# Altium project BW1097_R2M2E3.PrjPcb (part 9 of 10)
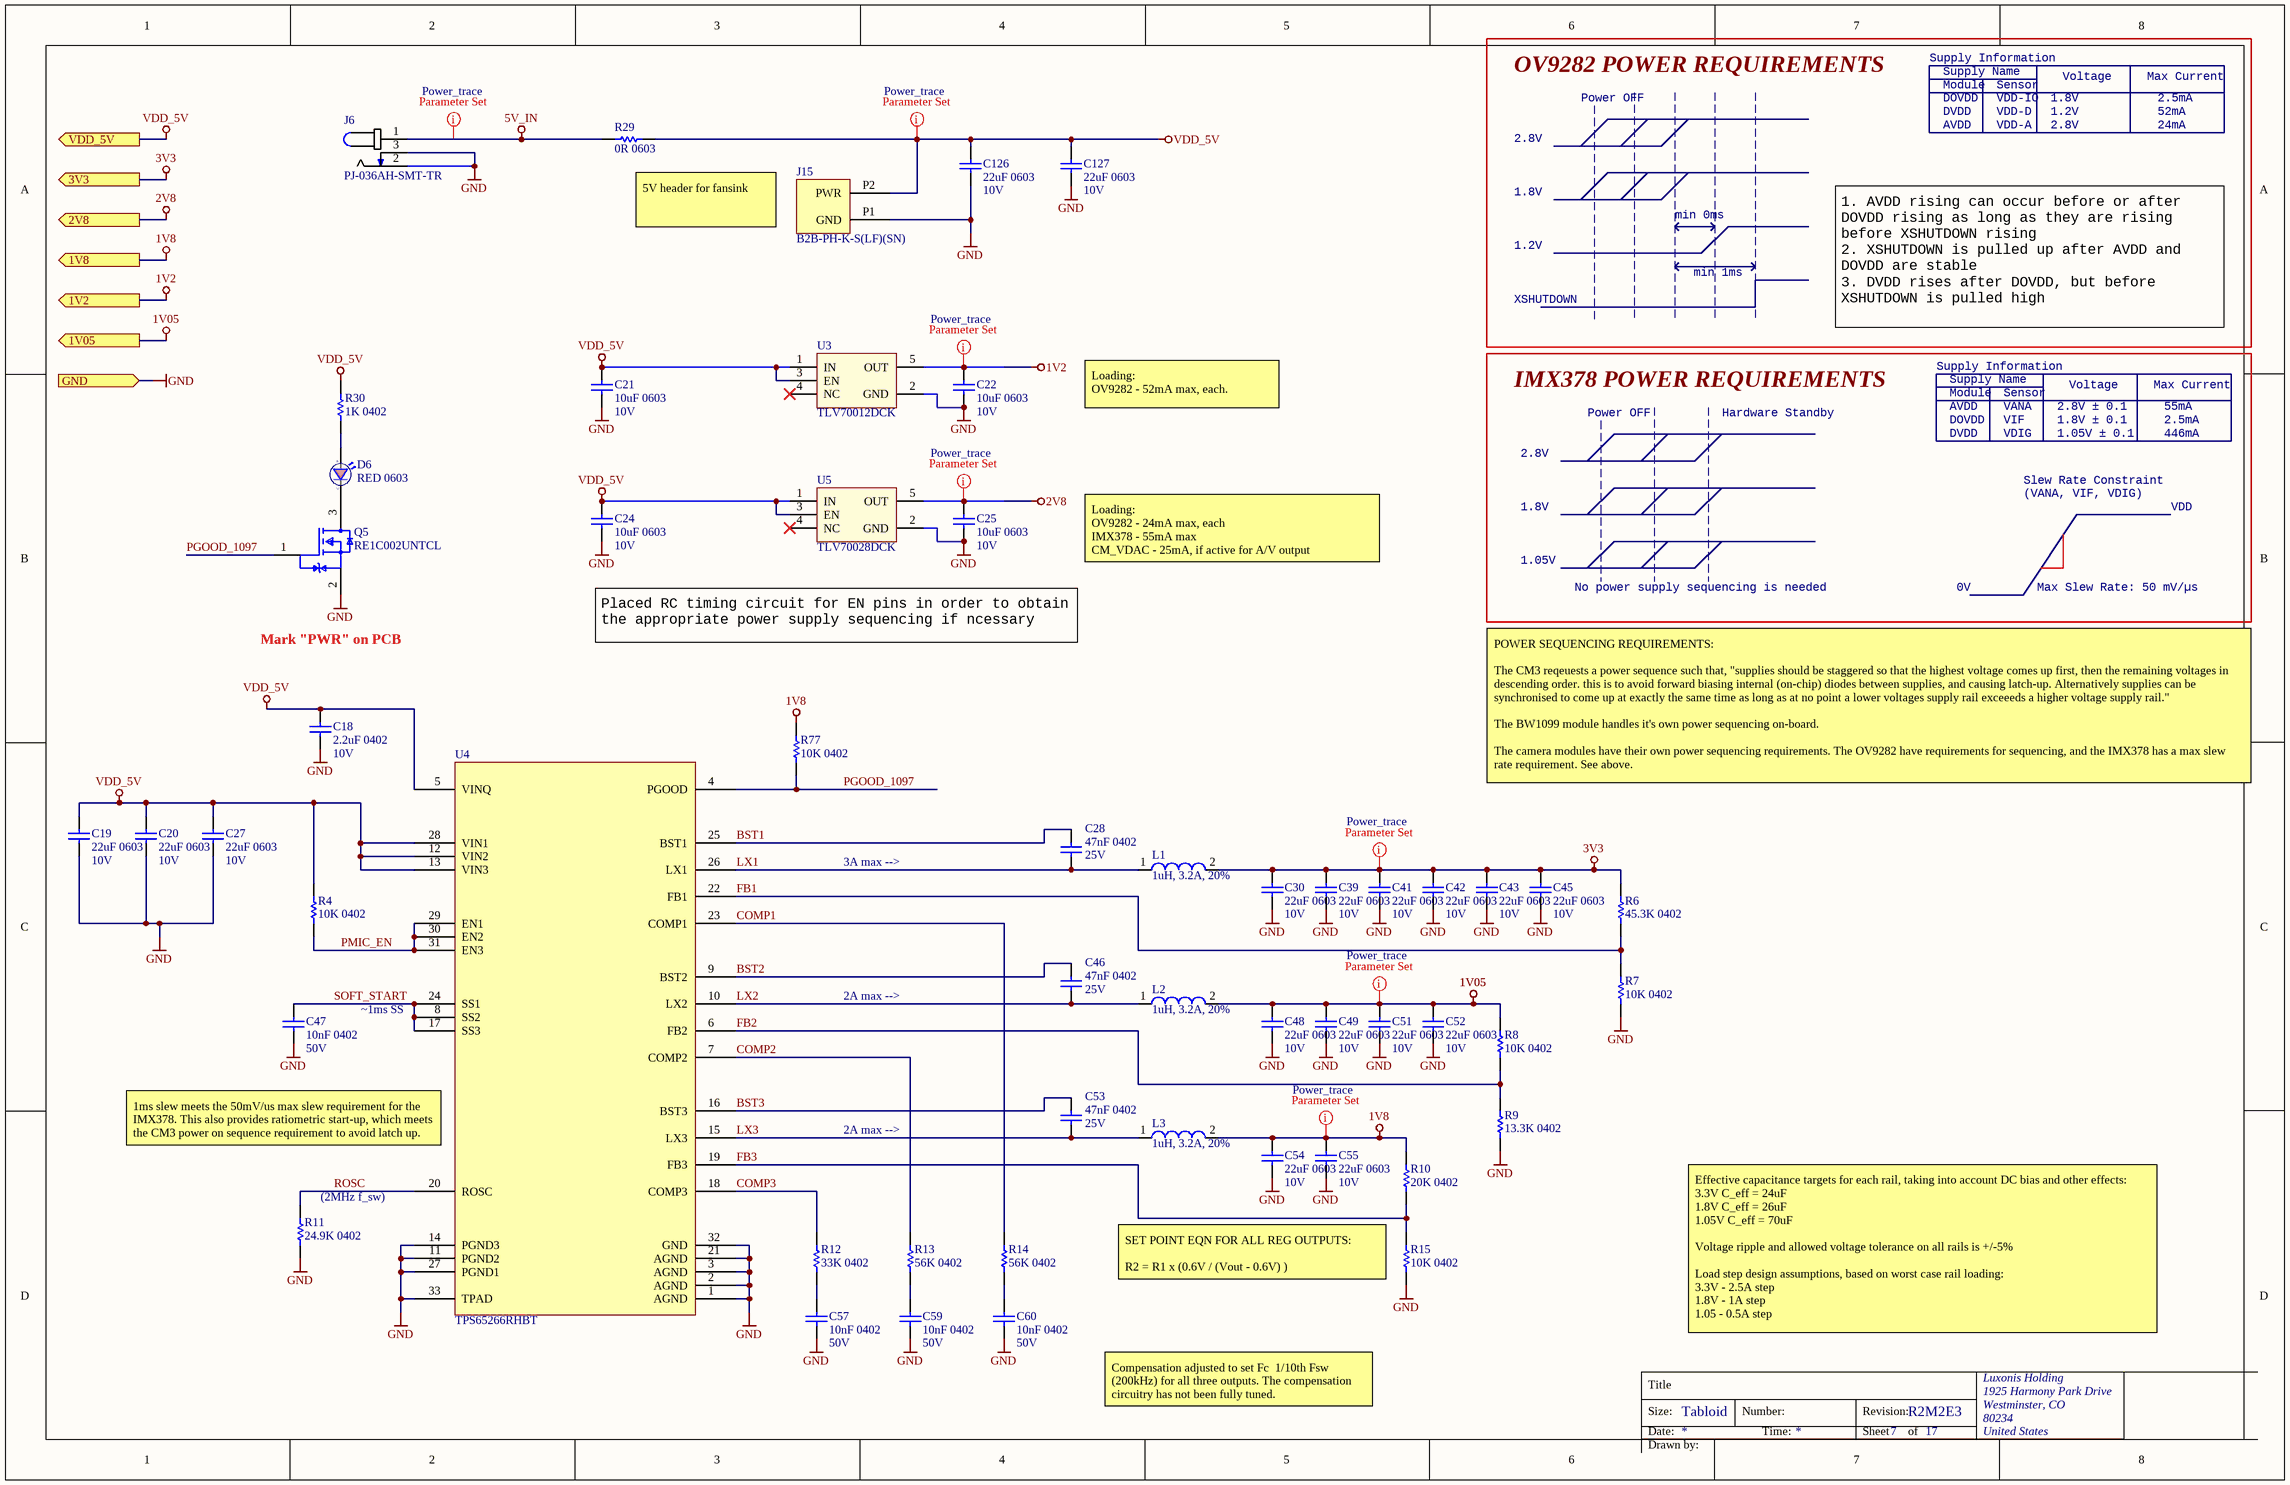
[diagram p116: BW1097_Power_Supply.SchDoc]

## Sheet BW1097_Power_Supply.SchDoc: =project_title (continued)

### Library data of the parts (continued)
U3 = TLV70012DCK: IC REG LINEAR 1.2V 200MA SC70-5; Manufacturer 1: Texas Instruments; Manufacturer Part Number 1: TLV70012DCKR; Max Power Dissipation: 320mW; Number of Outputs: 1; Dropout Voltage: 175mV; Max Input Voltage: 5.5V; Min Input Voltage: 2V; Min Current Limit: 220mA; Polarity: Positive; Accuracy: 2%; Quiescent Current: 30uA; Output Type: Fixed; Supplier 1: Digi-Key; Stock 1: 8389; Pricing 1: 1=0.48000, 10=0.40900, 100=0.30570, 500=0.24020, 1000=0.18561 (USD); RoHS: Yes; Case/Package: SC; Number of Pins: 5; Contact Plating: Gold; Min Operating Temperature: -40°C; Max Operating Temperature: 125°C; Output Voltage: 1.2V; Packaging: Tape and Reel; Output Current: 200mA; Package Quantity: 1; Max Output Current: 200mA; Number of Regulators: 1; Power Dissipation: 320mW; Min Output Voltage: 1.2V; Output Voltage Accuracy: 2%; Max Output Voltage: 1.2V; Nominal Output Voltage: 1.2V; Radiation Hardening: No; Lead Free: Lead Free; REACH SVHC: No SVHC; ComponentLink1URL: https://datasheet.ciiva.com/26909/tlv70012dckr-26909420.pdf?src-supplier=IIIC; ComponentLink1Description: https://datasheet.ciiva.com/26909/tlv70012dckr-26909420.pdf?src-supplier=IIIC; ComponentLink2URL: https://datasheet.ciiva.com/46448/1836520-46448747.pdf?src-supplier=Element14; ComponentLink2Description: https://datasheet.ciiva.com/46448/1836520-46448747.pdf?src-supplier=Element14; Supplier Part Number 1: 296-27438-1-ND; Supplier 2: TI store; Manufacturer 2: Texas Instruments; Manufacturer Part Number 2: TLV70012DCKT; Stock 2: 250; Pricing 2: 1=0.43000, 10=0.38000, 25=0.35000, 100=0.30000, 250=0.27000, 500=0.21000, 750=0.16000, 1000=0.14000 (USD); ComponentLink3URL: http://components.arrow.com/part/dataview/48874348S9524109N7713?src-supplier=Arrow; ComponentLink3Description: http://components.arrow.com/part/dataview/48874348S9524109N7713?src-supplier=Arrow; ComponentLink4URL: http://components.arrow.com/part/dataview/0323_02210905?src-supplier=Arrow+Europe; ComponentLink4Description: http://components.arrow.com/part/dataview/0323_02210905?src-supplier=Arrow+Europe; ComponentLink5URL: http://www.ti.com/general/docs/lit/getliterature.tsp?genericPartNumber=TLV700&&fileType=pdf&src-supplier=Avnet; ComponentLink5Description: http://www.ti.com/general/docs/lit/getliterature.tsp?genericPartNumber=TLV700&&fileType=pdf&src-supplier=Avnet; ComponentLink6URL: http://focus.ti.com/lit/ds/symlink/tlv70033.pdf?src-supplier=Avnet; ComponentLink6Description: http://focus.ti.com/lit/ds/symlink/tlv70033.pdf?src-supplier=Avnet; ComponentLink7URL: http://www.ti.com/lit/ds/slvsa00e/slvsa00e.pdf?src-supplier=Digi-Key; ComponentLink7Description: http://www.ti.com/lit/ds/slvsa00e/slvsa00e.pdf?src-supplier=Digi-Key; ComponentLink8URL: http://www.ti.com/litv/slvsa00d?src-supplier=Mouser; ComponentLink8Description: http://www.ti.com/litv/slvsa00d?src-supplier=Mouser; Supplier Part Number 2: TLV70012DCKT
U4 = TPS65266RHBT: IC REG BCK ADJ 3A/2A TRPL 32VQFN Buck Switching Regulator IC Positive Adjustable 0.6V 3 Output 3A, 2A 32-VFQFN Exposed Pad; Manufacturer 1: Texas Instruments; Manufacturer: TI; Switching Frequency: 2.4MHz; Number of Outputs: 3; Min Input Voltage: 2.7V; Max Input Voltage: 6.5V; Min Output Voltage: 600mV; Synchronous Rectifier: Yes; Quiescent Current: 340uA; Manufacturer Part Number 1: TPS65266RHBT; Manufacturer PN: TPS65266; Package: 32-VQFN; Supplier 1: Digi-Key; Stock 1: 4557; Pricing 1: 1=4.01000, 10=3.59900, 100=2.94850 (USD); RoHS: Yes; Mount: Surface Mount; Case/Package: VQFN; Number of Pins: 32; Weight: 0.002547oz; Min Operating Temperature: -40°C; Max Operating Temperature: 85°C; Packaging: Tape and Reel; Output Current: 2A; Package Quantity: 250; Max Output Voltage: 6.5V; Operating Supply Voltage: 6.5V; Output Type: Adjustable; Output Configuration: Positive; Current - Output 1: 3A; Current - Output 2: 2A; Lead Free: Lead Free; REACH SVHC: No SVHC; ComponentLink1URL: http://www.ti.com/general/docs/lit/getliterature.tsp?genericPartNumber=TPS65266&&fileType=pdf&src-supplier=Element14; ComponentLink1Description: http://www.ti.com/general/docs/lit/getliterature.tsp?genericPartNumber=TPS65266&&fileType=pdf&src-supplier=Element14; ComponentLink2URL: http://www.ti.com/general/docs/lit/getliterature.tsp?genericPartNumber=TPS65266&amp;&amp;fileType=pdf&src-supplier=Farnell; ComponentLink2Description: http://www.ti.com/general/docs/lit/getliterature.tsp?genericPartNumber=TPS65266&amp;&amp;fileType=pdf&src-supplier=Farnell; ComponentLink3URL: http://www.ti.com/general/docs/lit/getliterature.tsp?genericPartNumber=TPS65266&&fileType=pdf&src-supplier=Farnell; ComponentLink3Description: http://www.ti.com/general/docs/lit/getliterature.tsp?genericPartNumber=TPS65266&&fileType=pdf&src-supplier=Farnell; ComponentLink4URL: http://www.ti.com/lit/ds/symlink/tps65266.pdf?src-supplier=Digi-Key; ComponentLink4Description: http://www.ti.com/lit/ds/symlink/tps65266.pdf?src-supplier=Digi-Key; ComponentLink5URL: http://www.ti.com/lit/gpn/tps65266?src-supplier=Mouser; ComponentLink5Description: http://www.ti.com/lit/gpn/tps65266?src-supplier=Mouser; ComponentLink6URL: http://www.ti.com/general/docs/lit/getliterature.tsp?genericPartNumber=TPS65266&&fileType=pdf&src-supplier=Avnet; ComponentLink6Description: http://www.ti.com/general/docs/lit/getliterature.tsp?genericPartNumber=TPS65266&&fileType=pdf&src-supplier=Avnet; Supplier Part Number 1: 296-38685-1-ND; Supplier 2: TI store; Supplier 3: Mouser; Supplier Part Number 2: TPS65266RHBT; Supplier Part Number 3: 595-TPS65266RHBT
U5 = TLV70028DCK: IC REG LINEAR 2.8V 200MA SC70-5 Linear Voltage Regulator IC  1 Output  200mA SC-70-5; Manufacturer 1: Texas Instruments; Manufacturer Part Number 1: TLV70028DCKT; Dropout Voltage: 175mV; Number of Outputs: 1; Max Power Dissipation: 320mW; Max Input Voltage: 5.5V; Min Input Voltage: 2V; Min Current Limit: 220mA; Polarity: Positive; Quiescent Current: 30uA; Accuracy: 2%; Output Type: Fixed; Nominal Supply Current: 31uA; Supplier 1: Digi-Key; Stock 1: 832; Pricing 1: 1=0.55000, 10=0.46700, 100=0.34900 (USD); RoHS: Yes; Case/Package: SC; Number of Pins: 5; Contact Plating: Gold; Min Operating Temperature: -40°C; Max Operating Temperature: 125°C; Package Quantity: 1; Packaging: Tape and Reel; Output Current: 200mA; Output Voltage: 2.8V; Max Output Current: 200mA; Number of Regulators: 1; Power Dissipation: 320mW; Min Output Voltage: 2.8V; Output Voltage Accuracy: 2%; Max Output Voltage: 2.8V; Max Supply Voltage: 5.5V; Min Supply Voltage: 2V; Nominal Output Voltage: 2.8V; Power Rating: 320mW; Termination: SMD/SMT; Length: 2.15mm; Height: 1mm; Width: 1.4mm; Radiation Hardening: No; Lead Free: Lead Free; REACH SVHC: No SVHC; ComponentLink1URL: https://datasheet.ciiva.com/14149/tlv700-eng-ds-14149840.pdf?src-supplier=Distrelec; ComponentLink1Description: https://datasheet.ciiva.com/14149/tlv700-eng-ds-14149840.pdf?src-supplier=Distrelec; ComponentLink2URL: https://datasheet.ciiva.com/22700/1882059-22700172.pdf?src-supplier=Element14; ComponentLink2Description: https://datasheet.ciiva.com/22700/1882059-22700172.pdf?src-supplier=Element14; Supplier 2: Digi-Key; Manufacturer 2: Texas Instruments; Manufacturer Part Number 2: TLV70028DCKR; Stock 2: 30013; Pricing 2: 1=0.48000, 10=0.40900, 100=0.30570, 500=0.24020, 1000=0.18561 (USD); ComponentLink3URL: http://components.arrow.com/part/dataview/0323_00585634?src-supplier=Arrow+Europe; ComponentLink3Description: http://components.arrow.com/part/dataview/0323_00585634?src-supplier=Arrow+Europe; ComponentLink4URL: http://focus.ti.com/lit/ds/symlink/tlv70033.pdf?src-supplier=Avnet+Europe; ComponentLink4Description: http://focus.ti.com/lit/ds/symlink/tlv70033.pdf?src-supplier=Avnet+Europe; ComponentLink5URL: http://www.ti.com/lit/ds/slvsa00d/slvsa00d.pdf?src-supplier=Digi-Key; ComponentLink5Description: http://www.ti.com/lit/ds/slvsa00d/slvsa00d.pdf?src-supplier=Digi-Key; ComponentLink6URL: http://www.ti.com/lit/pdf/slyy050?src-supplier=Digi-Key; ComponentLink6Description: http://www.ti.com/lit/pdf/slyy050?src-supplier=Digi-Key; ComponentLink7URL: http://www.ti.com/general/docs/lit/getliterature.tsp?genericPartNumber=TLV700&&fileType=pdf&src-supplier=Avnet+Asia; ComponentLink7Description: http://www.ti.com/general/docs/lit/getliterature.tsp?genericPartNumber=TLV700&&fileType=pdf&src-supplier=Avnet+Asia; ComponentLink8URL: http://www.ti.com/general/docs/lit/getliterature.tsp?genericPartNumber=TLV700&&fileType=pdf&src-supplier=Avnet; ComponentLink8Description: http://www.ti.com/general/docs/lit/getliterature.tsp?genericPartNumber=TLV700&&fileType=pdf&src-supplier=Avnet; ComponentLink9URL: http://components.arrow.com/part/dataview/48329233S8322732N7713?src-supplier=Arrow; ComponentLink9Description: http://components.arrow.com/part/dataview/48329233S8322732N7713?src-supplier=Arrow; ComponentLink10URL: http://www.ti.com/litv/slvsa00d?src-supplier=Mouser; ComponentLink10Description: http://www.ti.com/litv/slvsa00d?src-supplier=Mouser; ComponentLink11URL: http://www.ti.com/lit/ds/slvsa00e/slvsa00e.pdf?src-supplier=Digi-Key; ComponentLink11Description: http://www.ti.com/lit/ds/slvsa00e/slvsa00e.pdf?src-supplier=Digi-Key; Supplier Part Number 1: 296-25271-1-ND; Supplier Part Number 2: 296-39279-1-ND

## Sheet BW1097_HDMI.SchDoc: =project_title
size Tabloid; CompanyName: Luxonis Holding; DrawnBy: Brian Weinstein; Organization: Luxonis Holding; Address1: 1925 Harmony Park Drive; Address2: Westminster, CO; Address3: 80234; Address4: United States; DocumentNumber: D0000196; Revision: R2M2E3; SheetNumber: 12; SheetTotal: 17
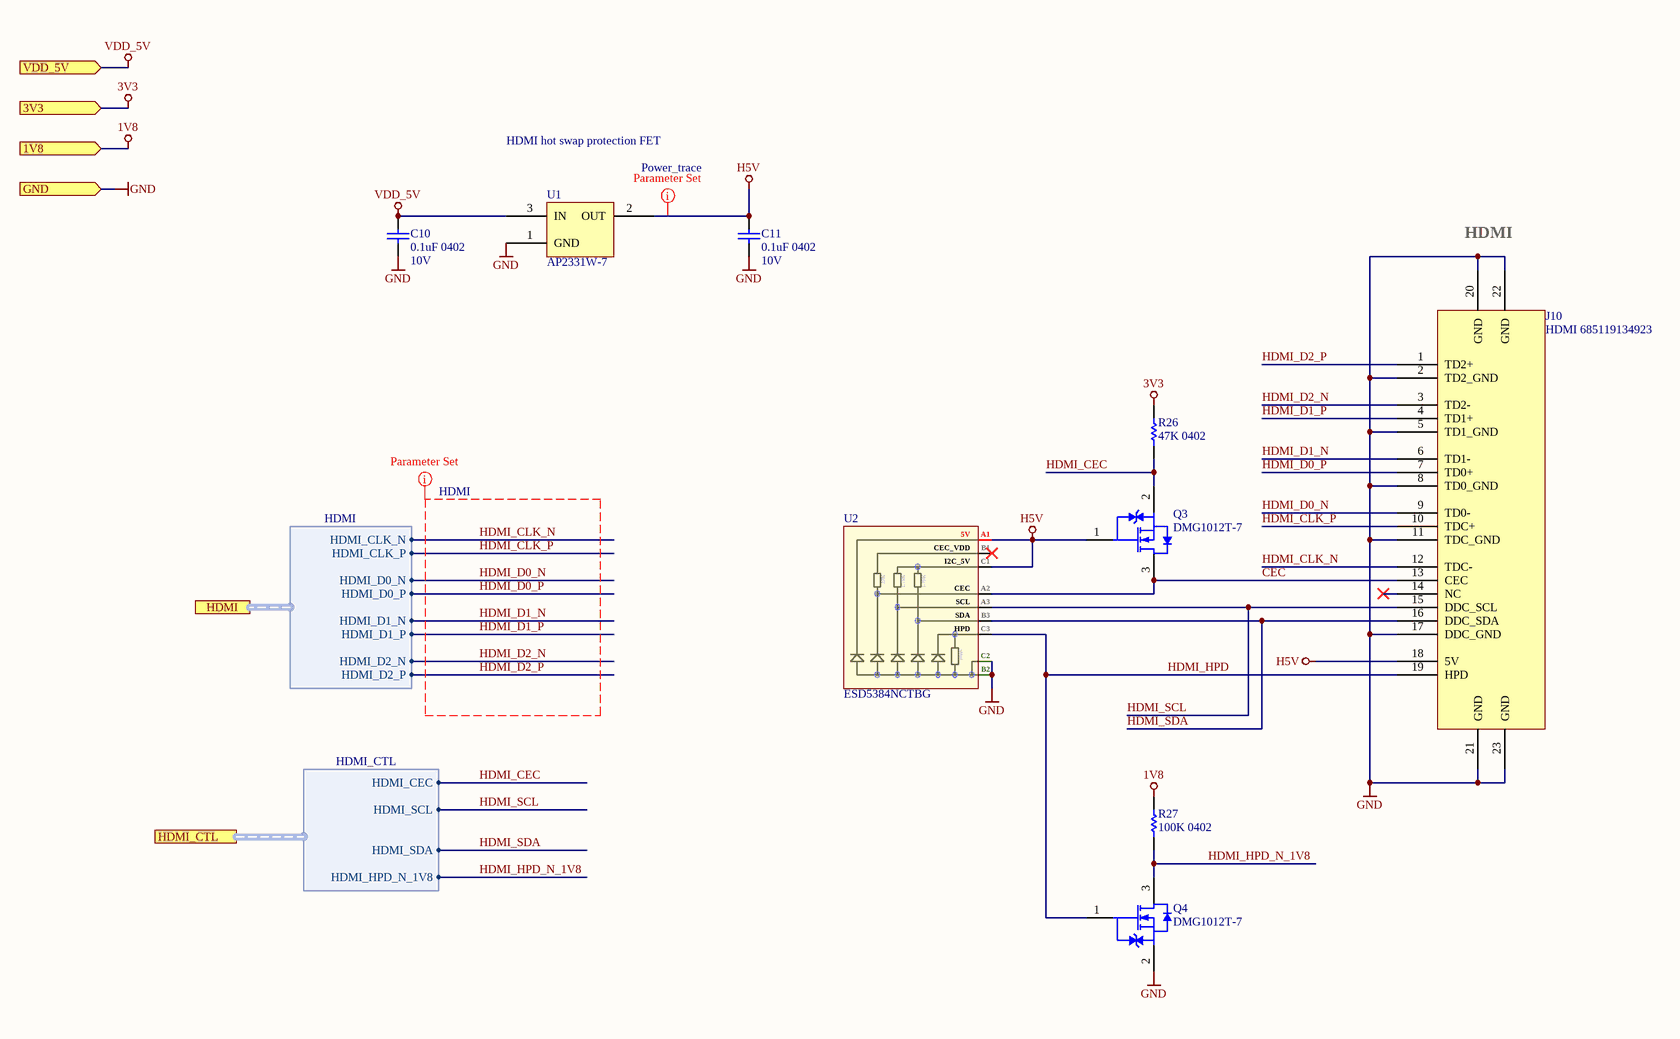
[diagram p12: BW1097_HDMI.SchDoc]

### Parts
C10  0.1uF 0402  Voltage Rating: 10V  [CAPC0402(1005)70_N]
C11  0.1uF 0402  Voltage Rating: 10V  [CAPC0402(1005)70_N]
J10  HDMI 685119134923  [685119134923]
Q3  DMG1012T-7  [DMG1012T-7]
Q4  DMG1012T-7  [DMG1012T-7]
R26  47K 0402  [RESC0402(1005)_N]
R27  100K 0402  [RESC0402(1005)_N]
U1  AP2331W-7  [AP2331W-7]
U2  ESD5384NCTBG  [ESD5384NCTBG]

### Ports
1V8 (in), 3V3 (in), GND (in), HDMI (harness HDMI), HDMI_CTL (harness HDMI_CTL), VDD_5V (in)

### Harnesses
HDMI_CTL: HDMI_CEC, HDMI_SCL, HDMI_SDA, HDMI_HPD_N_1V8
HDMI: HDMI_CLK_N, HDMI_CLK_P, HDMI_D0_N, HDMI_D0_P, HDMI_D1_N, HDMI_D1_P, HDMI_D2_N, HDMI_D2_P

### Nets
1V8: R27.2 ; port 1V8
3V3: R26.2 ; port 3V3
GND: C10.1 C11.1 J10.2(TD2_GND) J10.5(TD1_GND) J10.8(TD0_GND) J10.11(TDC_GND) J10.17(DDC_GND) J10.20(GND) J10.21(GND) J10.22(GND) J10.23(GND) Q4.2 U1.1(GND) U2.B2 U2.C2 ; port GND
H5V: C11.2 J10.18(5V) Q3.1 U1.2(OUT) U2.A1 U2.C1
VDD_5V: C10.2 U1.3(IN) ; port VDD_5V
CEC: J10.13(CEC) Q3.3 U2.A2
HDMI_CEC: Q3.2 R26.1 ; port HDMI_CTL.HDMI_CEC
HDMI_CLK_N: J10.12(TDC-) ; port HDMI.HDMI_CLK_N
HDMI_CLK_P: J10.10(TDC+) ; port HDMI.HDMI_CLK_P
HDMI_D0_N: J10.9(TD0-) ; port HDMI.HDMI_D0_N
HDMI_D0_P: J10.7(TD0+) ; port HDMI.HDMI_D0_P
HDMI_D1_N: J10.6(TD1-) ; port HDMI.HDMI_D1_N
HDMI_D1_P: J10.4(TD1+) ; port HDMI.HDMI_D1_P
HDMI_D2_N: J10.3(TD2-) ; port HDMI.HDMI_D2_N
HDMI_D2_P: J10.1(TD2+) ; port HDMI.HDMI_D2_P
HDMI_HPD: J10.19(HPD) Q4.1 U2.C3
HDMI_HPD_N_1V8: Q4.3 R27.1 ; port HDMI_CTL.HDMI_HPD_N_1V8
HDMI_SCL: J10.15(DDC_SCL) U2.A3 ; port HDMI_CTL.HDMI_SCL
HDMI_SDA: J10.16(DDC_SDA) U2.B3 ; port HDMI_CTL.HDMI_SDA

Not connected (* = marked no-connect by the designer): J10 14(NC)*; U2 B1*

### Layout directives
net class Power_trace: H5V
net class HDMI; rule Matched Net Lengths [Tolerance = 50mil]: HDMI_CLK_N, HDMI_CLK_P, HDMI_D0_N, HDMI_D0_P, HDMI_D1_N, HDMI_D1_P, HDMI_D2_N, HDMI_D2_P

### Notes on the sheet
- HDMI hot swap protection FET
- HDMI
- Title
- Size:
- Date:
- Tabloid
- Number:
- Time:
- Revision:
- Sheet
- of
- Drawn by:
- (in symbol ESD5384NCTBG) 5V; CEC_VDD; I2C_5V; 27K; 1.75K; CEC; SCL; SDA; HPD; 100K

### Library data of the parts
C10 C11 = GRM155R71A104JA01D: as C56 on sheet BW1097_HUB; Manufacturer Part Number 1: GRM155R71A104JA01D; Supplier 1: Digi-Key; Stock 1: 1346709; Pricing 1: 1=0.10000, 10=0.02500, 100=0.01130, 500=0.00806, 1000=0.00633, 2500=0.00575, 5000=0.00529 (USD); RoHS: Yes; Mount: Surface Mount; Case/Package: 0402; Case Code (Imperial): 0402; Case Code (Metric): 1005; Min Operating Temperature: -55°C; Max Operating Temperature: 125°C; Tolerance: 5%; Packaging: Tape and Reel; Voltage Rating (DC): 10V; Dielectric: X7R; Package Quantity: 10000; Termination: SMD/SMT; Length: 1mm; Height: 0.5mm; Width: 0.02inch; Thickness: 0.022inch; Depth: 0.5mm; Radiation Hardening: No; Lead Free: Lead Free; ComponentLink1URL: https://datasheet.ciiva.com/5411/product-5411135.pdf?src-supplier=Mouser; ComponentLink1Description: https://datasheet.ciiva.com/5411/product-5411135.pdf?src-supplier=Mouser; ComponentLink2URL: https://datasheet.ciiva.com/11618/c02e-11618821.pdf?src-supplier=Avnet; ComponentLink2Description: https://datasheet.ciiva.com/11618/c02e-11618821.pdf?src-supplier=Avnet; Supplier Part Number 1: 490-10777-1-ND
J10 = 685119134923: CONN RCPT HDMI 19POS SMD R/A; Manufacturer 1: Wurth Electronics; Body Material: Plastic; Gender: Receptacle; Connector Type: HDMI,Socket; Number of Contacts: 19; Manufacturer Part Number 1: 685119134923; Supplier 1: Digi-Key; Stock 1: 3955; Pricing 1: 1=2.36000, 10=2.33000, 50=2.11100, 100=1.89300 (USD); RoHS: Yes; Mount: Surface Mount,Horizontal; Contact Material: Bronze; Color: Black; Package Quantity: 250; Packaging: Tape and Reel; Number of Positions: 19; Termination: SMD/SMT; Orientation: Right Angle; Features: Shielded; Length: 12.15mm; Height: 5.55mm; Width: 15mm; REACH SVHC: Unknown; ComponentLink1URL: https://datasheet.ciiva.com/851/685119134923-851552.pdf?src-supplier=Digi-Key; ComponentLink1Description: https://datasheet.ciiva.com/851/685119134923-851552.pdf?src-supplier=Digi-Key; ComponentLink2URL: https://datasheet.ciiva.com/5053/685119134923-63804-5053219.pdf?src-supplier=Mouser; ComponentLink2Description: https://datasheet.ciiva.com/5053/685119134923-63804-5053219.pdf?src-supplier=Mouser; ComponentLink3URL: https://datasheet.ciiva.com/1095/638362-1095543.pdf?src-supplier=Newark; ComponentLink3Description: https://datasheet.ciiva.com/1095/638362-1095543.pdf?src-supplier=Newark; ComponentLink4URL: https://datasheet.ciiva.com/851/685119134923-851553.pdf?src-supplier=Digi-Key; ComponentLink4Description: https://datasheet.ciiva.com/851/685119134923-851553.pdf?src-supplier=Digi-Key; ComponentLink5URL: https://datasheet.ciiva.com/1094/638362-1094939.pdf?src-supplier=Element14; ComponentLink5Description: https://datasheet.ciiva.com/1094/638362-1094939.pdf?src-supplier=Element14; ComponentLink6URL: https://datasheet.ciiva.com/14118/4257090-eng-datasheet-14118205.pdf?src-supplier=Distrelec; ComponentLink6Description: https://datasheet.ciiva.com/14118/4257090-eng-datasheet-14118205.pdf?src-supplier=Distrelec; Supplier Part Number 1: 732-2737-1-ND; Supplier 2: Newark; Supplier 3: Mouser; Supplier Part Number 2: 13T9717; Supplier Part Number 3: 710-685119134923
Q3 Q4 = DMG1012T-7: as Q6 on sheet BW1097_HUB; Manufacturer Part Number 1: DMG1012T-7; Supplier 1: Digi-Key; Stock 1: 1268946; Pricing 1: 1=0.30000, 10=0.24600, 100=0.10070, 500=0.08396, 1000=0.05834 (USD); RoHS: Yes; Mount: Surface Mount; Case/Package: SOT-523; Number of Pins: 3; Weight: 7.1E-05oz; Contact Plating: Tin,Matte; Min Operating Temperature: -55°C; Max Operating Temperature: 150°C; Continuous Drain Current (ID): 630mA; Packaging: Tape and Reel; Drain to Source Voltage (Vdss): 20V; Package Quantity: 3000; Drain to Source Breakdown Voltage: 20V; Power Dissipation: 280mW; Number of Channels: 1; On-State Resistance: 400MR; Length: 1.7mm; Height: 0.8mm; Width: 0.85mm; Radiation Hardening: No; REACH SVHC: No SVHC; Lead Free: Lead Free; ComponentLink1URL: https://datasheet.ciiva.com/934/ds31783-934512.pdf?src-supplier=Digi-Key; ComponentLink1Description: https://datasheet.ciiva.com/934/ds31783-934512.pdf?src-supplier=Digi-Key; ComponentLink2URL: https://datasheet.ciiva.com/4442/ds31783-44973-4442944.pdf?src-supplier=Mouser; ComponentLink2Description: https://datasheet.ciiva.com/4442/ds31783-44973-4442944.pdf?src-supplier=Mouser; ComponentLink3URL: https://datasheet.ciiva.com/11174/ds31783-11174965.pdf?src-supplier=Avnet; ComponentLink3Description: https://datasheet.ciiva.com/11174/ds31783-11174965.pdf?src-supplier=Avnet; ComponentLink4URL: https://datasheet.ciiva.com/17324/ds31783-17324010.pdf?src-supplier=Avnet+Europe; ComponentLink4Description: https://datasheet.ciiva.com/17324/ds31783-17324010.pdf?src-supplier=Avnet+Europe; ComponentLink5URL: https://datasheet.ciiva.com/6383/ds31783-6383803.pdf?src-supplier=Digi-Key; ComponentLink5Description: https://datasheet.ciiva.com/6383/ds31783-6383803.pdf?src-supplier=Digi-Key; ComponentLink6URL: https://datasheet.ciiva.com/934/ds31783-934511.pdf?src-supplier=Digi-Key; ComponentLink6Description: https://datasheet.ciiva.com/934/ds31783-934511.pdf?src-supplier=Digi-Key; Supplier Part Number 1: DMG1012T-7DICT-ND; Supplier 2: Mouser; Supplier Part Number 2: 621-DMG1012T-7
R26 = RC0402FR-0747KL: as R38 on sheet BW1097_HUB; Manufacturer Part Number 1: RC0402FR-0747KL; Supplier 1: Digi-Key; Stock 1: 8672261; Pricing 1: 1=0.10000, 10=0.01600, 100=0.00640, 1000=0.00289, 2500=0.00251, 5000=0.00207 (USD); RoHS: Yes; Case/Package: 0402; Case Code (Imperial): 0402; Case Code (Metric): 1005; Min Operating Temperature: -55°C; Max Operating Temperature: 155°C; Tolerance: 1%; Packaging: Tape and Reel; Composition: Thick Film; Termination: SMD/SMT; Package Quantity: 1; Number of Terminations: 2; Military Standard: Not; Features: Moisture Resistant; Length: 1mm; Height: 0.016inch; Width: 0.5mm; Depth: 0.5mm; Lead Free: Lead Free; REACH SVHC: Unknown; ComponentLink1URL: https://datasheet.ciiva.com/16793/pyu-rc0402-51-rohs-l-6-r-16793430.pdf?src-supplier=Future+Electronics; ComponentLink1Description: https://datasheet.ciiva.com/16793/pyu-rc0402-51-rohs-l-6-r-16793430.pdf?src-supplier=Future+Electronics; ComponentLink2URL: https://datasheet.ciiva.com/46412/1018594-46412839.pdf?src-supplier=Element14; ComponentLink2Description: https://datasheet.ciiva.com/46412/1018594-46412839.pdf?src-supplier=Element14; ComponentLink3URL: https://datasheet.ciiva.com/15189/getdatasheetpartid-323748-15189466.pdf?src-supplier=Verical; ComponentLink3Description: https://datasheet.ciiva.com/15189/getdatasheetpartid-323748-15189466.pdf?src-supplier=Verical; ComponentLink4URL: https://datasheet.ciiva.com/2453/pyu-r-int-thick-7-2453388.pdf?src-supplier=Digi-Key; ComponentLink4Description: https://datasheet.ciiva.com/2453/pyu-r-int-thick-7-2453388.pdf?src-supplier=Digi-Key; ComponentLink5URL: https://datasheet.ciiva.com/2453/pyu-r-int-thick-7-2453389.pdf?src-supplier=Digi-Key; ComponentLink5Description: https://datasheet.ciiva.com/2453/pyu-r-int-thick-7-2453389.pdf?src-supplier=Digi-Key; ComponentLink6URL: https://datasheet.ciiva.com/2453/pyu-r-int-thick-7-2453390.pdf?src-supplier=Digi-Key; ComponentLink6Description: https://datasheet.ciiva.com/2453/pyu-r-int-thick-7-2453390.pdf?src-supplier=Digi-Key; Supplier 2: Newark; Supplier Part Number 1: 311-47.0KLRCT-ND; Supplier Part Number 2: 26M6788
R27 = RC0402FR-07100KL: RES SMD 100K OHM 1% 1/16W 0402; Manufacturer 1: Yageo; Power Rating: 63mW; Resistance: 100kR; Temperature Coefficient: 100ppm/°C; Voltage Rating: 50V; Manufacturer Part Number 1: RC0402FR-07100KL; Supplier 1: Digi-Key; Stock 1: 50867324; Pricing 1: 1=0.10000, 10=0.01500, 100=0.00600, 1000=0.00270, 2500=0.00235, 5000=0.00194 (USD); RoHS: Yes; Case/Package: 0402; Case Code (Metric): 1005; Case Code (Imperial): 0402; Min Operating Temperature: -55°C; Max Operating Temperature: 155°C; Tolerance: 1%; Packaging: Tape and Reel; Composition: Thick Film; Termination: SMD/SMT; Military Standard: Not; Package Quantity: 1; Number of Terminations: 2; Max Power Dissipation: 63mW; Features: Moisture Resistant; Working Voltage: 50V; Length: 0.039inch; Height: 0.016inch; Width: 0.02inch; Depth: 0.5mm; Lead Free: Lead Free; REACH SVHC: No SVHC; ComponentLink1URL: https://datasheet.ciiva.com/11819/0900766b80c66297-11819452.pdf?src-supplier=RSComponents; ComponentLink1Description: https://datasheet.ciiva.com/11819/0900766b80c66297-11819452.pdf?src-supplier=RSComponents; ComponentLink2URL: https://datasheet.ciiva.com/2453/pyu-r-int-thick-7-2453361.pdf?src-supplier=Digi-Key; ComponentLink2Description: https://datasheet.ciiva.com/2453/pyu-r-int-thick-7-2453361.pdf?src-supplier=Digi-Key; ComponentLink3URL: https://datasheet.ciiva.com/2453/pyu-r-int-thick-7-2453362.pdf?src-supplier=Digi-Key; ComponentLink3Description: https://datasheet.ciiva.com/2453/pyu-r-int-thick-7-2453362.pdf?src-supplier=Digi-Key; ComponentLink4URL: https://datasheet.ciiva.com/2453/pyu-r-int-thick-7-2453363.pdf?src-supplier=Digi-Key; ComponentLink4Description: https://datasheet.ciiva.com/2453/pyu-r-int-thick-7-2453363.pdf?src-supplier=Digi-Key; ComponentLink5URL: https://datasheet.ciiva.com/22747/1018594-22747509.pdf?src-supplier=Element14; ComponentLink5Description: https://datasheet.ciiva.com/22747/1018594-22747509.pdf?src-supplier=Element14; ComponentLink6URL: https://datasheet.ciiva.com/15189/getdatasheetpartid-323696-15189334.pdf?src-supplier=Verical; ComponentLink6Description: https://datasheet.ciiva.com/15189/getdatasheetpartid-323696-15189334.pdf?src-supplier=Verical; ComponentLink7URL: https://datasheet.ciiva.com/12667/pyu-rc0402-51-rohs-l-6-r-12667930.pdf?src-supplier=Mouser; ComponentLink7Description: https://datasheet.ciiva.com/12667/pyu-rc0402-51-rohs-l-6-r-12667930.pdf?src-supplier=Mouser; Supplier 2: Newark; Supplier 3: Mouser; Supplier Part Number 1: 311-100KLRCT-ND; Supplier Part Number 2: 67R9887; Supplier Part Number 3: 603-RC0402FR-07100KL
U1 = AP2331W-7: LOAD SWITCH SC59; Manufacturer 1: Diodes; Number of Outputs: 1; Output Current: 200mA; Max Supply Voltage: 5.2V; Min Supply Voltage: 2.7V; Interface: On/Off; On-State Resistance: 350mR; Turn-On Delay Time: 700us; Fault Protection: Over Temperature,Reverse Current; Output Configuration: High Side; Manufacturer Part Number 1: AP2331W-7; Supplier 1: Digi-Key; Stock 1: 5467; Pricing 1: 1=0.40000, 10=0.34100, 100=0.23660, 500=0.19110, 1000=0.14105 (USD); RoHS: Yes; Mount: Surface Mount; Case/Package: TO-236-3; Number of Pins: 59; Min Operating Temperature: -40°C; Max Operating Temperature: 85°C; Package Quantity: 3000; Packaging: Tape and Reel; Max Output Current: 200mA; Voltage: 5.2V; Current: 200mA; Length: 3.1mm; Height: 1.3mm; Width: 1.7mm; Radiation Hardening: No; REACH SVHC: No SVHC; ComponentLink1URL: https://datasheet.ciiva.com/18567/ap2331-18567929.pdf?src-supplier=Digi-Key; ComponentLink1Description: https://datasheet.ciiva.com/18567/ap2331-18567929.pdf?src-supplier=Digi-Key; ComponentLink2URL: https://datasheet.ciiva.com/18567/ap2331-18567928.pdf?src-supplier=Digi-Key; ComponentLink2Description: https://datasheet.ciiva.com/18567/ap2331-18567928.pdf?src-supplier=Digi-Key; ComponentLink3URL: https://datasheet.ciiva.com/18567/ap2331-18567930.pdf?src-supplier=Digi-Key; ComponentLink3Description: https://datasheet.ciiva.com/18567/ap2331-18567930.pdf?src-supplier=Digi-Key; Supplier 2: Mouser; Supplier 3: Arrow; Supplier Part Number 2: 621-AP2331W-7; Supplier Part Number 1: AP2331W-7DICT-ND; Supplier Part Number 3: AP2331W-7
U2 = ESD5384NCTBG: TVS DIODE 3V 9WLCSP; Manufacturer 1: ON Semiconductor; Direction: Unidirectional; Min Breakdown Voltage: 6V; ESD Protection: Yes; Max Reverse Leakage Current: 200nA; Number of Lines: 5; Capacitance: 29pF; Power Line Protection: No; Manufacturer Part Number 1: ESD5384NCTBG; Supplier 1: Digi-Key; Stock 1: 729; Pricing 1: 1=0.45000, 10=0.38600, 100=0.26780, 500=0.20910, 1000=0.16995 (USD); RoHS: Yes; Number of Pins: 9; Min Operating Temperature: -30°C; Max Operating Temperature: 85°C; Package Quantity: 5000; Packaging: Tape and Reel; Reverse Standoff Voltage: 3V; Number of Unidirectional Channels: 5; Composition: Zener; Length: 1.14mm; Height: 0.63mm; Width: 1.14mm; Depth: 1.14mm; Radiation Hardening: No; Lead Free: Lead Free; Halogen Free: Halogen Free; ComponentLink1URL: https://datasheet.ciiva.com/11195/esd5384-d-11195286.pdf?src-supplier=Avnet; ComponentLink1Description: https://datasheet.ciiva.com/11195/esd5384-d-11195286.pdf?src-supplier=Avnet; ComponentLink2URL: https://datasheet.ciiva.com/12545/esd5384-d-119513-12545067.pdf?src-supplier=Mouser; ComponentLink2Description: https://datasheet.ciiva.com/12545/esd5384-d-119513-12545067.pdf?src-supplier=Mouser; ComponentLink3URL: https://datasheet.ciiva.com/354/esd5384-d-354168.pdf?src-supplier=Digi-Key; ComponentLink3Description: https://datasheet.ciiva.com/354/esd5384-d-354168.pdf?src-supplier=Digi-Key; Supplier 2: RSComponents; Supplier Part Number 1: ESD5384NCTBGOSCT-ND; Supplier Part Number 2: 8010213

## Sheet Project_Information.SchDoc: =project_title
size Tabloid; CompanyName: Luxonis Holding; DrawnBy: Brian Weinstein; Organization: Luxonis Holding; Address1: 1925 Harmony Park Drive; Address2: Westminster, CO; Address3: 80234; Address4: United States; DocumentNumber: D0000196; Revision: R2M2E3; SheetNumber: 1; SheetTotal: 17
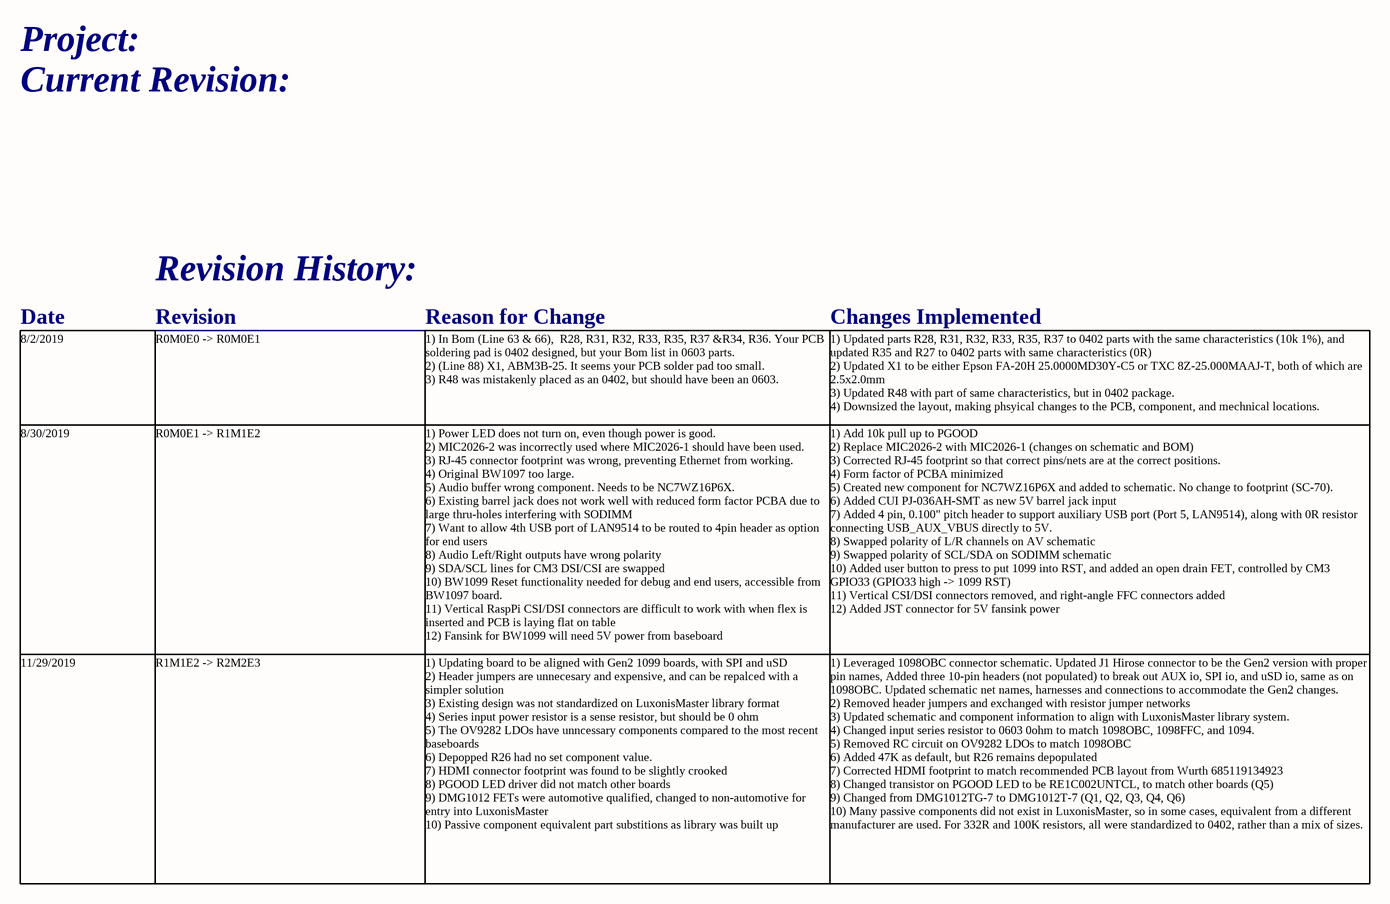
[diagram p13: Project_Information.SchDoc]

### Notes on the sheet
- Project:
- Current Revision:
- Revision History:
- Date
- Revision
- Reason for Change
- Changes Implemented
- 8/2/2019
- R0M0E0 -> R0M0E1
- 1) In Bom (Line 63 & 66),  R28, R31, R32, R33, R35, R37 &R34, R36. Your PCB soldering pad is 0402 designed, but your Bom list in 0603 parts.
  2) (Line 88) X1, ABM3B-25. It seems your PCB solder pad too small.
  3) R48 was mistakenly placed as an 0402, but should have been an 0603.
- 1) Updated parts R28, R31, R32, R33, R35, R37 to 0402 parts with the same characteristics (10k 1%), and updated R35 and R27 to 0402 parts with same characteristics (0R)
  2) Updated X1 to be either Epson FA-20H 25.0000MD30Y-C5 or TXC 8Z-25.000MAAJ-T, both of which are 2.5x2.0mm
  3) Updated R48 with part of same characteristics, but in 0402 package.
  4) Downsized the layout, making phsyical changes to the PCB, component, and mechnical locations.
- 8/30/2019
- R0M0E1 -> R1M1E2
- 1) Power LED does not turn on, even though power is good.
  2) MIC2026-2 was incorrectly used where MIC2026-1 should have been used.
  3) RJ-45 connector footprint was wrong, preventing Ethernet from working.
  4) Original BW1097 too large.
  5) Audio buffer wrong component. Needs to be NC7WZ16P6X.
  6) Existing barrel jack does not work well with reduced form factor PCBA due to large thru-holes interfering with SODIMM
  7) Want to allow 4th USB port of LAN9514 to be routed to 4pin header as option for end users
  8) Audio Left/Right outputs have wrong polarity
  9) SDA/SCL lines for CM3 DSI/CSI are swapped
  10) BW1099 Reset functionality needed for debug and end users, accessible from BW1097 board.
  11) Vertical RaspPi CSI/DSI connectors are difficult to work with when flex is inserted and PCB is laying flat on table
  12) Fansink for BW1099 will need 5V power from baseboard
- 1) Add 10k pull up to PGOOD
  2) Replace MIC2026-2 with MIC2026-1 (changes on schematic and BOM)
  3) Corrected RJ-45 footprint so that correct pins/nets are at the correct positions.
  4) Form factor of PCBA minimized
  5) Created new component for NC7WZ16P6X and added to schematic. No change to footprint (SC-70).
  6) Added CUI PJ-036AH-SMT as new 5V barrel jack input
  7) Added 4 pin, 0.100" pitch header to support auxiliary USB port (Port 5, LAN9514), along with 0R resistor connecting USB_AUX_VBUS directly to 5V.
  8) Swapped polarity of L/R channels on AV schematic
  9) Swapped polarity of SCL/SDA on SODIMM schematic
  10) Added user button to press to put 1099 into RST, and added an open drain FET, controlled by CM3 GPIO33 (GPIO33 high -> 1099 RST)
  11) Vertical CSI/DSI connectors removed, and right-angle FFC connectors added
  12) Added JST connector for 5V fansink power
- 11/29/2019
- R1M1E2 -> R2M2E3
- 1) Updating board to be aligned with Gen2 1099 boards, with SPI and uSD
  2) Header jumpers are unnecesary and expensive, and can be repalced with a simpler solution
  3) Existing design was not standardized on LuxonisMaster library format
  4) Series input power resistor is a sense resistor, but should be 0 ohm
  5) The OV9282 LDOs have unncessary components compared to the most recent baseboards
  6) Depopped R26 had no set component value.
  7) HDMI connector footprint was found to be slightly crooked
  8) PGOOD LED driver did not match other boards
  9) DMG1012 FETs were automotive qualified, changed to non-automotive for entry into LuxonisMaster
  10) Passive component equivalent part substitions as library was built up
- 1) Leveraged 1098OBC connector schematic. Updated J1 Hirose connector to be the Gen2 version with proper pin names, Added three 10-pin headers (not populated) to break out AUX io, SPI io, and uSD io, same as on 1098OBC. Updated schematic net names, harnesses and connections to accommodate the Gen2 changes.
  2) Removed header jumpers and exchanged with resistor jumper networks
  3) Updated schematic and component information to align with LuxonisMaster library system.
  4) Changed input series resistor to 0603 0ohm to match 1098OBC, 1098FFC, and 1094.
  5) Removed RC circuit on OV9282 LDOs to match 1098OBC
  6) Added 47K as default, but R26 remains depopulated
  7) Corrected HDMI footprint to match recommended PCB layout from Wurth 685119134923
  8) Changed transistor on PGOOD LED to be RE1C002UNTCL, to match other boards (Q5)
  9) Changed from DMG1012TG-7 to DMG1012T-7 (Q1, Q2, Q3, Q4, Q6)
  10) Many passive components did not exist in LuxonisMaster, so in some cases, equivalent from a different manufacturer are used. For 332R and 100K resistors, all were standardized to 0402, rather than a mix of sizes.
- Title
- Size:
- Date:
- Tabloid
- Number:
- Time:
- Revision:
- Sheet
- of
- Drawn by: